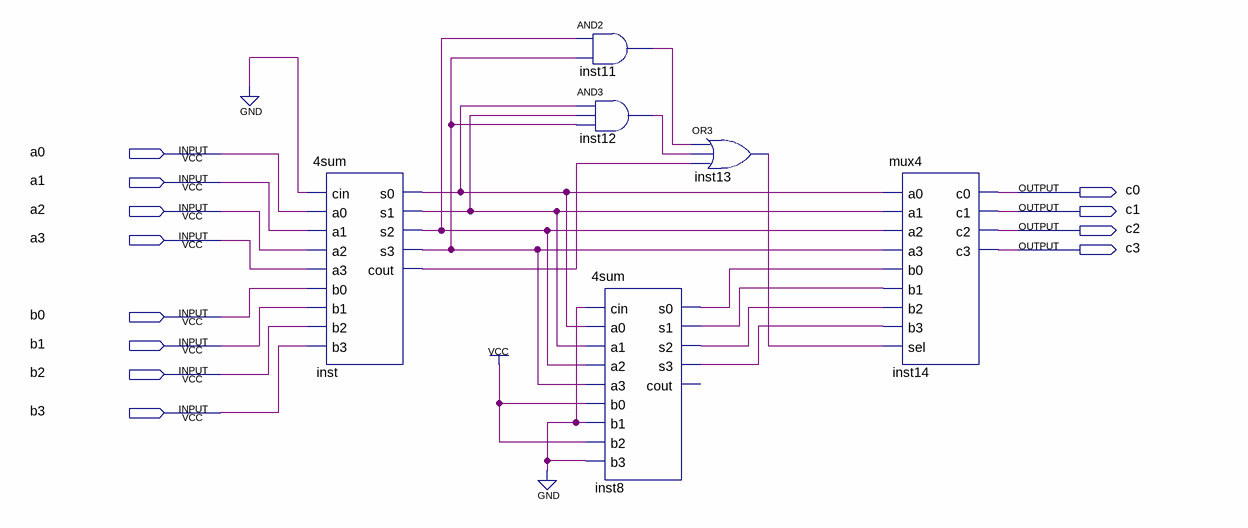
[diagram p0: schematic sheet]
// Quartus schematic sum11.bdf as structural Verilog: 6 symbols, 12 pins
module sum11 (
  input  a0,
  input  a1,
  input  a2,
  input  a3,
  input  b0,
  input  b1,
  input  b2,
  input  b3,
  output c0,
  output c1,
  output c2,
  output c3
);

  wire inst8_s0, inst8_s1, inst8_s2, inst8_s3, inst11_out, inst12_out, inst13_out, inst_cout, inst_s0,
       inst_s1, inst_s2, inst_s3;

  \4sum  inst (
    .cin(1'b0), .a0(a0), .a1(a1), .a2(a2), .a3(a3), .b0(b0), .b1(b1), .b2(b2), .b3(b3), .s0(inst_s0),
    .s1(inst_s1), .s2(inst_s2), .s3(inst_s3), .cout(inst_cout));
  and inst11 (inst11_out, inst_s2, inst_s3);
  and inst12 (inst12_out, inst_s0, inst_s1, inst_s3);
  \4sum  inst8 (
    .cin(1'b0), .a0(inst_s0), .a1(inst_s1), .a2(inst_s2), .a3(inst_s3), .b0(1'b1), .b1(1'b0), .b2(1'b1),
    .b3(1'b0), .s0(inst8_s0), .s1(inst8_s1), .s2(inst8_s2), .s3(inst8_s3));  // open: cout
  or inst13 (inst13_out, inst11_out, inst12_out, inst_cout);
  mux4 inst14 (
    .a0(inst_s0), .a1(inst_s1), .a2(inst_s2), .a3(inst_s3), .b0(inst8_s0), .b1(inst8_s1), .b2(inst8_s2),
    .b3(inst8_s3), .sel(inst13_out), .c0(c0), .c1(c1), .c2(c2), .c3(c3));
endmodule
